# Altium schematic sheet ReversePolaritySchematic.SchDoc
size A4
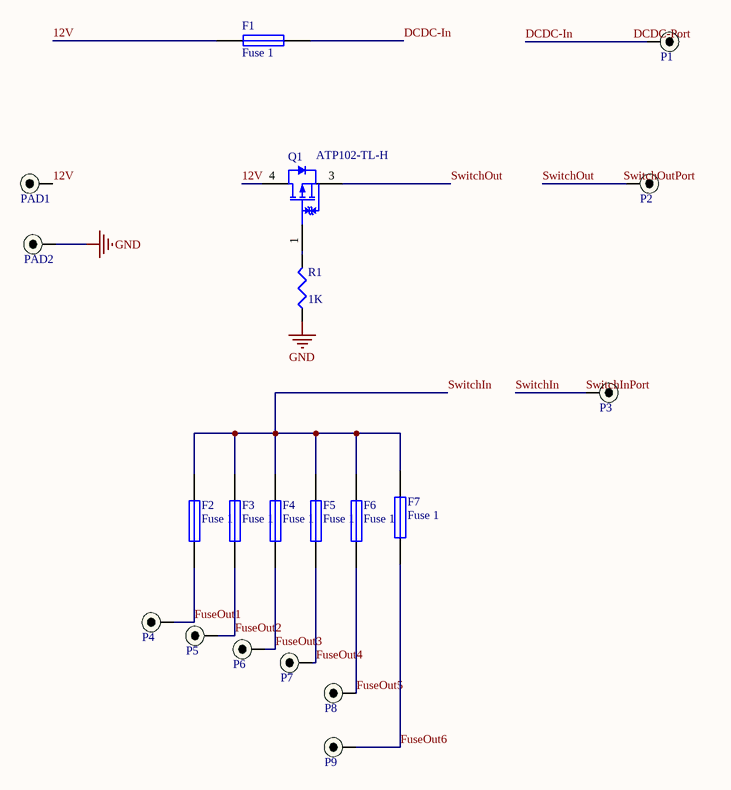
[diagram p0: ReversePolaritySchematic.SchDoc]

## Parts
F1  Fuse 1  [fuseholder]
F2  Fuse 1  [fuseholder]
F3  Fuse 1  [fuseholder]
F4  Fuse 1  [fuseholder]
F5  Fuse 1  [fuseholder]
F6  Fuse 1  [fuseholder]
F7  Fuse 1  [fuseholder]
P1  EXPOSED SOLDER PAD  [ScrewTerminalMount]  (value not drawn)
P2  EXPOSED SOLDER PAD  [ScrewTerminalMount]  (value not drawn)
P3  EXPOSED SOLDER PAD  [ScrewTerminalMount]  (value not drawn)
P4  EXPOSED SOLDER PAD  [ScrewTerminalMount]  (value not drawn)
P5  EXPOSED SOLDER PAD  [ScrewTerminalMount]  (value not drawn)
P6  EXPOSED SOLDER PAD  [ScrewTerminalMount]  (value not drawn)
P7  EXPOSED SOLDER PAD  [ScrewTerminalMount]  (value not drawn)
P8  EXPOSED SOLDER PAD  [ScrewTerminalMount]  (value not drawn)
P9  EXPOSED SOLDER PAD  [ScrewTerminalMount]  (value not drawn)
PAD1  EXPOSED SOLDER PAD  [PAD - duplicate]  (value not drawn)
PAD2  EXPOSED SOLDER PAD  [PAD - duplicate]  (value not drawn)
Q1  ATP102-TL-H  [ONSC-ATPAK-3-369AM_V]
R1  value 1K  [14-1210]  (hidden comment: Res3)

## Nets
GND: PAD2.1(PAD) R1.1
12V: F1.1 PAD1.1(PAD) Q1.4(D)
DCDC-In: F1.2 P1.1(PAD)  [also labelled DCDC-Port]
FuseOut1: F2.1 P4.1(PAD)
FuseOut2: F3.1 P5.1(PAD)
FuseOut3: F4.1 P6.1(PAD)
FuseOut4: F5.1 P7.1(PAD)
FuseOut5: F6.1 P8.1(PAD)
FuseOut6: F7.1 P9.1(PAD)
SwitchIn: F2.2 F3.2 F4.2 F5.2 F6.2 F7.2 P3.1(PAD)  [also labelled SwitchInPort]
SwitchOut: P2.1(PAD) Q1.3(S)  [also labelled SwitchOutPort]
NetQ1_1: Q1.1(G) R1.2

## Library data of the parts
F1-F7 = Fuse 1: Fuse; Published: 8-Jun-2000; LatestRevisionDate: 17-Jul-2002; LatestRevisionNote: Re-released for DXP Platform.; PackageReference: PIN-W2/E2.8; Publisher: Altium Limited; PackageDescription: Thru-Hole; 2 Leads
P1-P9 PAD1 PAD2 = EXPOSED SOLDER PAD: testing point
Q1 = ATP102-TL-H: P-Channel Power MOSFET, -30 V, -40 A, 18.5 mOhm, Single, 3-Pin ATPAK, Pb-Free, Tape and Reel; Manufacturer: On Semiconductor; PD Max (W): 40; VGS(th) Max (V): 2.6; Crss Typ (pF): 270; Channel Polarity: P Channel; Coss Typ (pF): 360; V(BR)DSS Min (V): 30; Ciss Typ (pF): 1490; VGS Max (V): 20; PartNumber: ATP102-TL-H; ComponentLink1Description: Manufacturer URL; ComponentLink2Description: Datasheet; ComponentLink3URL: http://www.onsemi.com/pub_link/Collateral/369AM.PDF; ComponentLink1URL: http://www.onsemi.com/; Packing: Tape and Reel; Package Type: DPAK (Single Gauge) / ATPAK; ID Max (A): 40; Configuration: Single; ComponentLink2URL: http://www.onsemi.com/pub_link/Collateral/ATP102-D.PDF; PackageReference: ATPAK-3-369AM; ComponentLink3Description: Package Specification; PackageVersion: Rev. O, 02/2012; RoHS: Pb-Free; Mounting Technology: Surface Mount; PackageDescription: 3-Pin Flange Mount, Body 6.5 x 7.3 mm, Pitch 2.3 mm
R1 = Res3: Resistor; Published: 8-Jun-2000; LatestRevisionDate: 29-May-2009; LatestRevisionNote: IPC-7351 Footprint Added.; PackageReference: J1-0603; Publisher: Altium Limited; PackageDescription: Chip Resistor